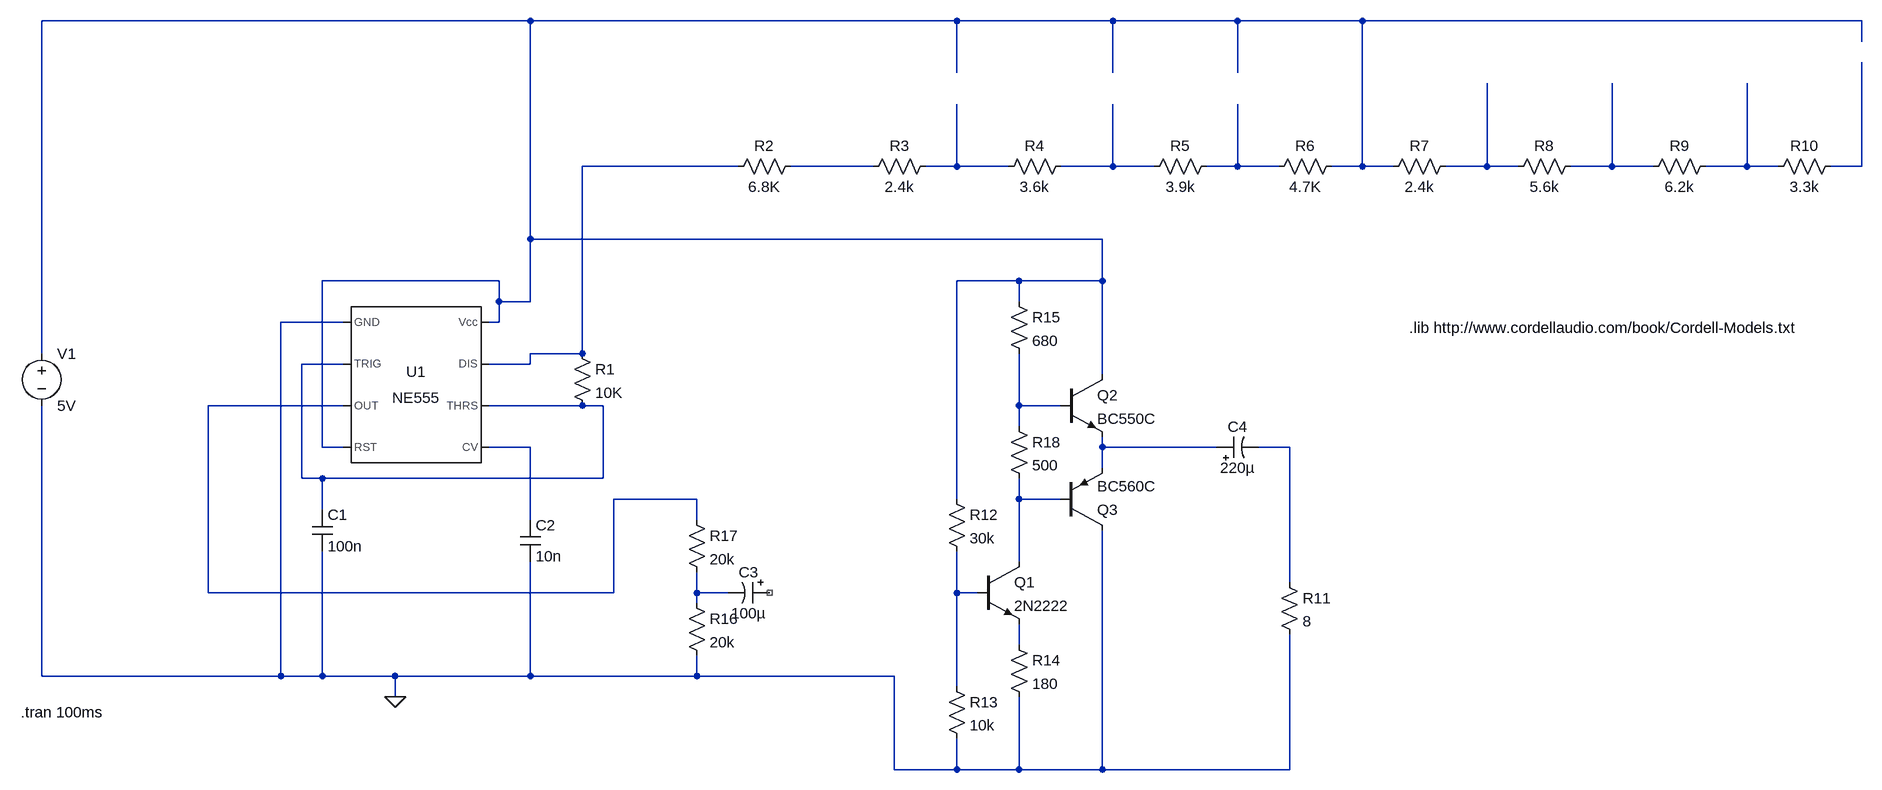
[diagram p0: schematic KR2.asc]
KR2.asc, the LTspice schematic file:
Version 4
SHEET 1 2360 680
WIRE 176 -496 -576 -496
WIRE 832 -496 176 -496
WIRE 1072 -496 832 -496
WIRE 1264 -496 1072 -496
WIRE 1456 -496 1264 -496
WIRE 2224 -496 1456 -496
WIRE 2224 -464 2224 -496
WIRE 832 -416 832 -496
WIRE 1072 -416 1072 -496
WIRE 1264 -416 1264 -496
WIRE 496 -272 256 -272
WIRE 704 -272 576 -272
WIRE 832 -272 832 -368
WIRE 832 -272 784 -272
WIRE 912 -272 832 -272
WIRE 1072 -272 1072 -368
WIRE 1072 -272 992 -272
WIRE 1136 -272 1072 -272
WIRE 1264 -272 1264 -368
WIRE 1264 -272 1216 -272
WIRE 1328 -272 1264 -272
WIRE 1456 -272 1456 -496
WIRE 1456 -272 1408 -272
WIRE 1504 -272 1456 -272
WIRE 1648 -272 1648 -400
WIRE 1648 -272 1584 -272
WIRE 1696 -272 1648 -272
WIRE 1840 -272 1840 -400
WIRE 1840 -272 1776 -272
WIRE 1904 -272 1840 -272
WIRE 2048 -272 2048 -400
WIRE 2048 -272 1984 -272
WIRE 2096 -272 2048 -272
WIRE 2224 -272 2224 -432
WIRE 2224 -272 2176 -272
WIRE 176 -160 176 -496
WIRE 1056 -160 176 -160
WIRE 128 -96 -144 -96
WIRE 928 -96 832 -96
WIRE 1056 -96 1056 -160
WIRE 1056 -96 928 -96
WIRE 128 -64 128 -96
WIRE 176 -64 176 -160
WIRE 176 -64 128 -64
WIRE 928 -64 928 -96
WIRE -112 -32 -208 -32
WIRE 128 -32 128 -64
WIRE 128 -32 112 -32
WIRE -576 16 -576 -496
WIRE 256 16 256 -272
WIRE 256 16 176 16
WIRE -112 32 -176 32
WIRE 176 32 176 16
WIRE 176 32 112 32
WIRE 1056 48 1056 -96
WIRE -112 96 -320 96
WIRE 256 96 112 96
WIRE 288 96 256 96
WIRE 928 96 928 16
WIRE 992 96 928 96
WIRE 928 128 928 96
WIRE -144 160 -144 -96
WIRE -112 160 -144 160
WIRE 176 160 112 160
WIRE 1056 160 1056 144
WIRE 1232 160 1056 160
WIRE 1344 160 1296 160
WIRE 1056 192 1056 160
WIRE -176 208 -176 32
WIRE -144 208 -176 208
WIRE 288 208 288 96
WIRE 288 208 -144 208
WIRE 432 240 304 240
WIRE 832 240 832 -96
WIRE 928 240 928 208
WIRE 992 240 928 240
WIRE -144 256 -144 208
WIRE 176 272 176 160
WIRE 432 272 432 240
WIRE 928 336 928 240
WIRE 1344 368 1344 160
WIRE -320 384 -320 96
WIRE 304 384 304 240
WIRE 304 384 -320 384
WIRE 432 384 432 352
WIRE 480 384 432 384
WIRE 832 384 832 320
WIRE 864 384 832 384
WIRE 432 400 432 384
WIRE 928 464 928 432
WIRE -576 512 -576 96
WIRE -208 512 -208 -32
WIRE -208 512 -576 512
WIRE -144 512 -144 320
WIRE -144 512 -208 512
WIRE -32 512 -144 512
WIRE 176 512 176 336
WIRE 176 512 -32 512
WIRE 432 512 432 480
WIRE 432 512 176 512
WIRE 736 512 432 512
WIRE 832 528 832 384
WIRE -32 544 -32 512
WIRE 736 656 736 512
WIRE 832 656 832 608
WIRE 832 656 736 656
WIRE 928 656 928 544
WIRE 928 656 832 656
WIRE 1056 656 1056 288
WIRE 1056 656 928 656
WIRE 1344 656 1344 448
WIRE 1344 656 1056 656
FLAG -32 544 0
SYMBOL Misc\\NE555 0 64 R0
SYMATTR InstName U1
SYMBOL voltage -576 0 R0
WINDOW 123 0 0 Left 2
WINDOW 39 0 0 Left 2
SYMATTR InstName V1
SYMATTR Value 5V
SYMBOL cap -160 256 R0
SYMATTR InstName C1
SYMATTR Value 100n
SYMBOL res 240 0 R0
SYMATTR InstName R1
SYMATTR Value 10K
SYMBOL cap 160 272 R0
SYMATTR InstName C2
SYMATTR Value 10n
SYMBOL res 592 -288 R90
WINDOW 0 0 56 VBottom 2
WINDOW 3 32 56 VTop 2
SYMATTR InstName R2
SYMATTR Value 6.8K
SYMBOL res 800 -288 R90
WINDOW 0 0 56 VBottom 2
WINDOW 3 32 56 VTop 2
SYMATTR InstName R3
SYMATTR Value 2.4k
SYMBOL res 1008 -288 R90
WINDOW 0 0 56 VBottom 2
WINDOW 3 32 56 VTop 2
SYMATTR InstName R4
SYMATTR Value 3.6k
SYMBOL res 1232 -288 R90
WINDOW 0 0 56 VBottom 2
WINDOW 3 32 56 VTop 2
SYMATTR InstName R5
SYMATTR Value 3.9k
SYMBOL res 1424 -288 R90
WINDOW 0 0 56 VBottom 2
WINDOW 3 32 56 VTop 2
SYMATTR InstName R6
SYMATTR Value 4.7K
SYMBOL res 1600 -288 R90
WINDOW 0 0 56 VBottom 2
WINDOW 3 32 56 VTop 2
SYMATTR InstName R7
SYMATTR Value 2.4k
SYMBOL res 1792 -288 R90
WINDOW 0 0 56 VBottom 2
WINDOW 3 32 56 VTop 2
SYMATTR InstName R8
SYMATTR Value 5.6k
SYMBOL res 2000 -288 R90
WINDOW 0 0 56 VBottom 2
WINDOW 3 32 56 VTop 2
SYMATTR InstName R9
SYMATTR Value 6.2k
SYMBOL res 2192 -288 R90
WINDOW 0 0 56 VBottom 2
WINDOW 3 32 56 VTop 2
SYMATTR InstName R10
SYMATTR Value 3.3k
SYMBOL polcap 544 368 R90
WINDOW 0 0 32 VBottom 2
WINDOW 3 32 32 VTop 2
SYMATTR InstName C3
SYMATTR Value 100µ
SYMATTR Description Capacitor
SYMATTR Type cap
SYMATTR SpiceLine V=16 Irms=3.72678 Rser=0.018 Lser=0
SYMBOL res 816 224 R0
SYMATTR InstName R12
SYMATTR Value 30k
SYMBOL res 816 512 R0
SYMATTR InstName R13
SYMATTR Value 10k
SYMBOL npn 864 336 R0
SYMATTR InstName Q1
SYMATTR Value 2N2222
SYMBOL npn 992 48 R0
SYMATTR InstName Q2
SYMATTR Value BC550C
SYMBOL res 912 -80 R0
SYMATTR InstName R15
SYMATTR Value 680
SYMBOL pnp 992 288 M180
SYMATTR InstName Q3
SYMATTR Value BC560C
SYMBOL res 1328 352 R0
SYMATTR InstName R11
SYMATTR Value 8
SYMBOL polcap 1232 176 R270
WINDOW 0 32 32 VTop 2
WINDOW 3 0 32 VBottom 2
SYMATTR InstName C4
SYMATTR Value 220µ
SYMATTR Description Capacitor
SYMATTR Type cap
SYMATTR SpiceLine V=63 Irms=135m Rser=1.06 Lser=0
SYMBOL res 416 384 R0
SYMATTR InstName R16
SYMATTR Value 20k
SYMBOL res 416 256 R0
SYMATTR InstName R17
SYMATTR Value 20k
SYMBOL res 912 448 R0
SYMATTR InstName R14
SYMATTR Value 180
SYMBOL res 912 112 R0
SYMATTR InstName R18
SYMATTR Value 500
TEXT -608 568 Left 2 !.tran 100ms
TEXT 1528 -24 Left 2 !.lib http://www.cordellaudio.com/book/Cordell-Models.txt

The netlist it stands for:
* KR2.asc
XU1 0 N011 N012 N001 N014 N011 N002 N001 NE555  ; pins GND TRIG OUT RST CV THRS DIS Vcc
V1 N001 0 5V
C1 N011 0 100n
R1 N002 N011 10K
C2 N014 0 10n
R2 N003 N002 6.8K
R3 N004 N003 2.4k
R4 N005 N004 3.6k
R5 N006 N005 3.9k
R6 N001 N006 4.7K
R7 N007 N001 2.4k
R8 N008 N007 5.6k
R9 N009 N008 6.2k
R10 N010 N009 3.3k
C3 NC_01 N018 100µ V=16 Irms=3.72678 Rser=0.018 Lser=0
R12 N001 N019 30k
R13 N019 0 10k
Q1 N017 N019 N020 0 2N2222
Q2 N001 N013 N015 0 BC550C
R15 N001 N013 680
Q3 0 N017 N015 0 BC560C
R11 N016 0 8
C4 N015 N016 220µ V=63 Irms=135m Rser=1.06 Lser=0
R16 N018 0 20k
R17 N012 N018 20k
R14 N020 0 180
R18 N013 N017 500
.model NPN NPN
.model PNP PNP
.lib standard.bjt
.tran 100ms
.lib http://www.cordellaudio.com/book/Cordell-Models.txt
.lib NE555.sub
.backanno
.end